# Altium schematic sheet Guide_laser.SchDoc
size 420 x 297 mm; Address1: Address1; Address2: Address2; Address3: Address3; Address4: Address4; DocumentNumber: *Э3; SheetNumber: 6; SheetTotal: 11; DocumentType: Схема электрическая *
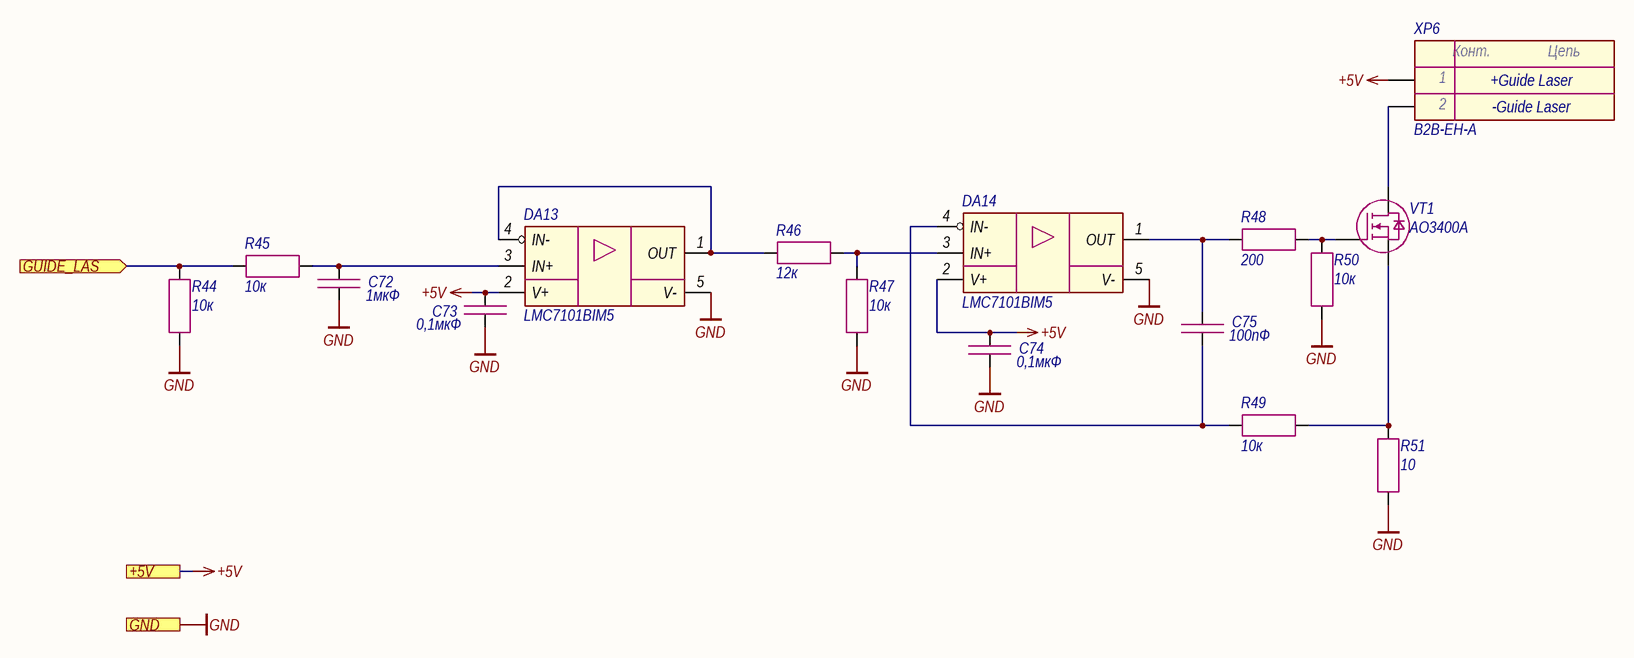
[diagram p0: Guide_laser.SchDoc]

## Parts
C72  1мкФ  [CAP_0603]
C73  0,1мкФ  [CAP_0603]
C74  0,1мкФ  [CAP_0603]
C75  100пФ  [CAP_0603]
DA13  LMC7101BIM5  [SOT-23-5]
DA14  LMC7101BIM5  [SOT-23-5]
R44  10к  [RES_0603]
R45  10к  [RES_0603]
R46  12к  [RES_0603]
R47  10к  [RES_0603]
R48  200  [RES_0603]
R49  10к  [RES_0603]
R50  10к  [RES_0603]
R51  10  [RES_1210]
VT1  AO3400A  [SOT-23-3]
XP6  B2B-EH-A  [B2B-EH-A]

## Ports
+5V (see Main[2A]), GND (see Main[2A], Ethernet[3D], Fiber_interlock[2C], Flow_sensor[2C], Hardwiring[3D], Indication[1C], LD_driver[1D], Power_supply[1D]), GUIDE_LAS (in, see Main[3A])

## Nets
+5V: C73.1 C74.1 DA13.2(V+) DA14.2(V+) XP6.1 ; port +5V
GND: C72.2 C73.2 C74.2 DA13.5(V-) DA14.5(V-) R44.1 R47.2 R50.1 R51.1 ; port GND
GUIDE_LAS: R44.2 R45.1 ; port GUIDE_LAS
NetC72_1: C72.1 DA13.3(IN+) R45.2
NetC75_1: C75.1 DA14.1(OUT) R48.1
NetC75_2: C75.2 DA14.4(IN-) R49.1
NetDA13_1: DA13.1(OUT) DA13.4(IN-) R46.1
NetDA14_3: DA14.3(IN+) R46.2 R47.1
NetR48_2: R48.2 R50.2 VT1.1(G)
NetR49_2: R49.2 R51.2 VT1.2(S)
NetVT1_3: VT1.3(D) XP6.2

## Notes on the sheet
- +Guide Laser
- -Guide Laser
- Подп. и дата
- Инв. № дубл.
- Взам. инв. №
- Инв. № подл.
- Изм.
- Лист
- № докум.
- Подп.
- Дата
- Копировал
- Формат А3
- (in symbol Connector-2) Конт.; Цепь

## Library data of the parts
C72 = Capacitor: Manufacturer: Murata; Model: GRM188R61H105KAALD; Value: 1мкФ; Document: *
C73 C74 = Capacitor: Manufacturer: Murata; Model: GRM188R71H104KA93D; Value: 0,1мкФ; Document: *
C75 = Capacitor: Manufacturer: Murata; Model: GRM1885C1H101JA01D; Value: 100пФ; Document: *
DA13 DA14 = LMC7101: Manufacturer: Texas Instruments; Model: LMC7101BIM5; Document: *
R44 R45 R47 R49 R50 = Resistor: Manufacturer: Yageo; Model: RC0603FR-0710KL; Value: 10к; Document: *
R46 = Resistor: Manufacturer: Yageo; Model: RC0603FR-0712KL; Value: 12к; Document: *
R48 = Resistor: Manufacturer: Yageo; Model: RC0603FR-07200RL; Value: 200; Document: *
R51 = Resistor: Manufacturer: Yageo; Model: RC1210FR-0710RL; Value: 10; Document: *
VT1 = MOSFET N-channel: Manufacturer: UMW; Model: AO3400A; Document: *
XP6 = Connector-2: Manufacturer: JST; Model: B2B-EH-A; Document: *